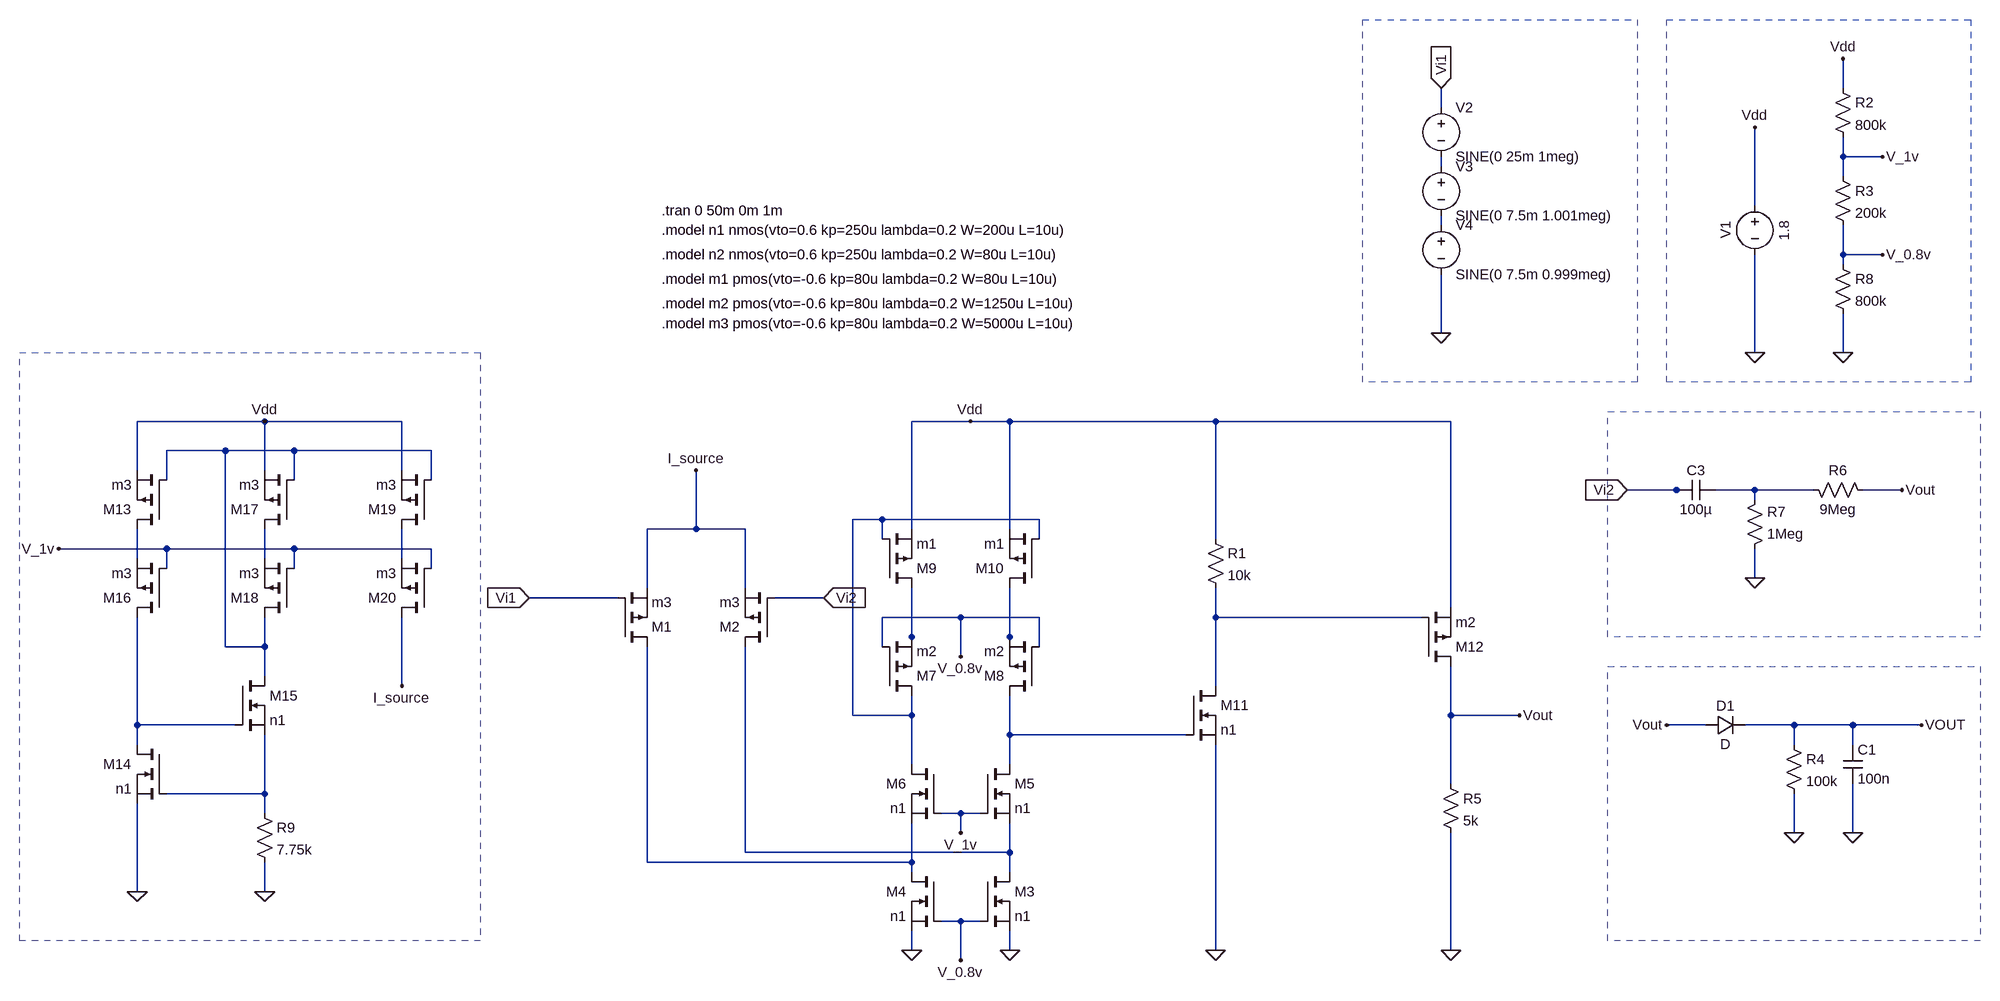
[diagram p0: schematic Draft19.asc]
Draft19.asc, the LTspice schematic file:
Version 4
SHEET 1 1988 868
WIRE 1696 -1040 1696 -1088
WIRE 1040 -1008 1040 -1040
WIRE 1696 -928 1696 -960
WIRE 1760 -928 1696 -928
WIRE 1040 -912 1040 -928
WIRE 1696 -896 1696 -928
WIRE 1552 -848 1552 -976
WIRE 1040 -816 1040 -832
WIRE 1696 -768 1696 -816
WIRE 1760 -768 1696 -768
WIRE 1696 -752 1696 -768
WIRE 1040 -640 1040 -736
WIRE 1552 -608 1552 -768
WIRE 1696 -608 1696 -672
WIRE -880 -496 -1088 -496
WIRE -656 -496 -880 -496
WIRE 272 -496 176 -496
WIRE 336 -496 272 -496
WIRE 672 -496 336 -496
WIRE 1056 -496 672 -496
WIRE -944 -448 -1040 -448
WIRE -832 -448 -944 -448
WIRE -608 -448 -832 -448
WIRE -1088 -416 -1088 -496
WIRE -880 -416 -880 -496
WIRE -656 -416 -656 -496
WIRE -1040 -400 -1040 -448
WIRE -832 -400 -832 -448
WIRE -608 -400 -608 -448
WIRE 1424 -384 1344 -384
WIRE 1440 -384 1424 -384
WIRE 1552 -384 1488 -384
WIRE 1648 -384 1552 -384
WIRE 1792 -384 1728 -384
WIRE 1552 -368 1552 -384
WIRE 128 -336 80 -336
WIRE 384 -336 128 -336
WIRE -176 -320 -176 -416
WIRE -176 -320 -256 -320
WIRE -96 -320 -176 -320
WIRE 176 -320 176 -496
WIRE 336 -320 336 -496
WIRE 128 -304 128 -336
WIRE 384 -304 384 -336
WIRE 672 -304 672 -496
WIRE -1040 -288 -1216 -288
WIRE -832 -288 -1040 -288
WIRE -608 -288 -832 -288
WIRE -1088 -272 -1088 -320
WIRE -880 -272 -880 -320
WIRE -656 -272 -656 -320
WIRE -1040 -256 -1040 -288
WIRE -832 -256 -832 -288
WIRE -608 -256 -608 -288
WIRE 1552 -240 1552 -288
WIRE -256 -224 -256 -320
WIRE -96 -224 -96 -320
WIRE -304 -208 -448 -208
WIRE 32 -208 -48 -208
WIRE 1056 -192 1056 -496
WIRE 256 -176 128 -176
WIRE 384 -176 256 -176
WIRE 672 -176 672 -224
WIRE 1008 -176 672 -176
WIRE 176 -144 176 -224
WIRE 336 -144 336 -224
WIRE -944 -128 -944 -448
WIRE -880 -128 -880 -176
WIRE -880 -128 -944 -128
WIRE 128 -128 128 -176
WIRE 176 -128 176 -144
WIRE 336 -128 336 -144
WIRE 384 -128 384 -176
WIRE 256 -112 256 -176
WIRE -880 -80 -880 -128
WIRE -656 -64 -656 -176
WIRE 672 -64 672 -176
WIRE 80 -16 80 -336
WIRE 176 -16 176 -48
WIRE 176 -16 80 -16
WIRE 1056 -16 1056 -96
WIRE 1168 -16 1056 -16
WIRE -1088 0 -1088 -176
WIRE -928 0 -1088 0
WIRE 1472 0 1408 0
WIRE 1616 0 1536 0
WIRE 1712 0 1616 0
WIRE 1824 0 1712 0
WIRE 336 16 336 -48
WIRE 624 16 336 16
WIRE -1088 32 -1088 0
WIRE 1616 32 1616 0
WIRE 1712 32 1712 0
WIRE 176 64 176 -16
WIRE 336 64 336 16
WIRE 1056 96 1056 -16
WIRE -880 112 -880 16
WIRE -880 112 -1040 112
WIRE -880 144 -880 112
WIRE 256 144 224 144
WIRE 288 144 256 144
WIRE 256 176 256 144
WIRE 1616 176 1616 112
WIRE 1712 176 1712 96
WIRE -96 208 -96 -128
WIRE 336 208 336 160
WIRE 336 208 -96 208
WIRE -256 224 -256 -128
WIRE 176 224 176 160
WIRE 176 224 -256 224
WIRE 176 240 176 224
WIRE 336 240 336 208
WIRE -1088 272 -1088 128
WIRE -880 272 -880 224
WIRE 256 320 224 320
WIRE 288 320 256 320
WIRE 176 368 176 336
WIRE 336 368 336 336
WIRE 672 368 672 32
WIRE 1056 368 1056 176
WIRE 256 384 256 320
FLAG 1552 -976 Vdd
FLAG 1552 -608 0
FLAG 272 -496 Vdd
FLAG 176 368 0
FLAG 336 368 0
FLAG 672 368 0
FLAG -448 -208 Vi1
IOPIN -448 -208 In
FLAG 1040 -1040 Vi1
IOPIN 1040 -1040 In
FLAG 1040 -640 0
FLAG 32 -208 Vi2
IOPIN 32 -208 In
FLAG 1056 368 0
FLAG 1552 -240 0
FLAG 1696 -608 0
FLAG 1696 -1088 Vdd
FLAG 1760 -928 V_1v
FLAG 256 176 V_1v
FLAG 1760 -768 V_0.8v
FLAG 256 -112 V_0.8v
FLAG 256 384 V_0.8v
FLAG -880 272 0
FLAG -1088 272 0
FLAG -880 -496 Vdd
FLAG -1216 -288 V_1v
FLAG -176 -416 I_source
FLAG -656 -64 I_source
FLAG 1792 -384 Vout
FLAG 1168 -16 Vout
FLAG 1344 -384 Vi2
IOPIN 1344 -384 In
FLAG 1616 176 0
FLAG 1712 176 0
FLAG 1408 0 Vout
FLAG 1824 0 VOUT
DATAFLAG -176 -320 ""
DATAFLAG -240 224 ""
DATAFLAG 336 208 ""
DATAFLAG 352 16 ""
DATAFLAG 336 -192 ""
DATAFLAG 176 0 ""
DATAFLAG 176 -208 ""
DATAFLAG 688 -176 ""
DATAFLAG 1056 0 ""
DATAFLAG 1696 -768 ""
DATAFLAG 1696 -928 ""
SYMBOL voltage 1552 -864 R0
WINDOW 0 -32 56 VBottom 2
WINDOW 3 32 56 VTop 2
WINDOW 123 0 0 Left 0
WINDOW 39 0 0 Left 0
SYMATTR InstName V1
SYMATTR Value 1.8
SYMBOL pmos -304 -128 M180
SYMATTR InstName M1
SYMATTR Value m3
SYMBOL pmos -48 -128 R180
SYMATTR InstName M2
SYMATTR Value m3
SYMBOL nmos 288 240 R0
SYMATTR InstName M3
SYMATTR Value n1
SYMBOL nmos 224 240 M0
SYMATTR InstName M4
SYMATTR Value n1
SYMBOL nmos 288 64 R0
SYMATTR InstName M5
SYMATTR Value n1
SYMBOL nmos 224 64 M0
SYMATTR InstName M6
SYMATTR Value n1
SYMBOL pmos 128 -48 M180
SYMATTR InstName M7
SYMATTR Value m2
SYMBOL pmos 384 -48 R180
SYMATTR InstName M8
SYMATTR Value m2
SYMBOL pmos 128 -224 M180
SYMATTR InstName M9
SYMATTR Value m1
SYMBOL pmos 384 -224 R180
SYMATTR InstName M10
SYMATTR Value m1
SYMBOL res 656 -320 R0
SYMATTR InstName R1
SYMATTR Value 10k
SYMBOL res 1040 80 R0
SYMATTR InstName R5
SYMATTR Value 5k
SYMBOL nmos 624 -64 R0
SYMATTR InstName M11
SYMATTR Value n1
SYMBOL pmos 1008 -96 M180
SYMATTR InstName M12
SYMATTR Value m2
SYMBOL res 1632 -400 M90
WINDOW 0 0 56 VBottom 2
WINDOW 3 32 56 VTop 2
SYMATTR InstName R6
SYMATTR Value 9Meg
SYMBOL res 1536 -272 M180
WINDOW 0 36 76 Left 2
WINDOW 3 36 40 Left 2
SYMATTR InstName R7
SYMATTR Value 1Meg
SYMBOL cap 1488 -400 R90
WINDOW 0 0 32 VBottom 2
WINDOW 3 32 32 VTop 2
SYMATTR InstName C3
SYMATTR Value 100µ
SYMBOL res 1680 -1056 R0
SYMATTR InstName R2
SYMATTR Value 800k
SYMBOL res 1680 -912 R0
SYMATTR InstName R3
SYMATTR Value 200k
SYMBOL res 1680 -768 R0
SYMATTR InstName R8
SYMATTR Value 800k
SYMBOL pmos -1040 -320 R180
SYMATTR InstName M13
SYMATTR Value m3
SYMBOL nmos -1040 32 M0
SYMATTR InstName M14
SYMATTR Value n1
SYMBOL nmos -928 -80 R0
SYMATTR InstName M15
SYMATTR Value n1
SYMBOL pmos -1040 -176 R180
SYMATTR InstName M16
SYMATTR Value m3
SYMBOL pmos -832 -320 R180
SYMATTR InstName M17
SYMATTR Value m3
SYMBOL pmos -832 -176 R180
SYMATTR InstName M18
SYMATTR Value m3
SYMBOL pmos -608 -320 R180
SYMATTR InstName M19
SYMATTR Value m3
SYMBOL pmos -608 -176 R180
SYMATTR InstName M20
SYMATTR Value m3
SYMBOL res -896 128 R0
SYMATTR InstName R9
SYMATTR Value 7.75k
SYMBOL voltage 1040 -1024 R0
WINDOW 123 0 0 Left 0
WINDOW 39 0 0 Left 0
SYMATTR InstName V2
SYMATTR Value SINE(0 25m 1meg)
SYMBOL voltage 1040 -928 R0
WINDOW 123 0 0 Left 0
WINDOW 39 0 0 Left 0
SYMATTR InstName V3
SYMATTR Value SINE(0 7.5m 1.001meg)
SYMBOL voltage 1040 -832 R0
WINDOW 123 0 0 Left 0
WINDOW 39 0 0 Left 0
SYMATTR InstName V4
SYMATTR Value SINE(0 7.5m 0.999meg)
SYMBOL cap 1696 32 R0
SYMATTR InstName C1
SYMATTR Value 100n
SYMBOL res 1600 16 R0
SYMATTR InstName R4
SYMATTR Value 100k
SYMBOL diode 1472 16 R270
WINDOW 0 32 32 VTop 2
WINDOW 3 0 32 VBottom 2
SYMATTR InstName D1
TEXT -232 -688 Left 2 !.model m2 pmos(vto=-0.6 kp=80u lambda=0.2 W=1250u L=10u)
TEXT -232 -840 Left 2 !.tran 0 50m 0m 1m
TEXT -232 -808 Left 2 !.model n1 nmos(vto=0.6 kp=250u lambda=0.2 W=200u L=10u)
TEXT -232 -768 Left 2 !.model n2 nmos(vto=0.6 kp=250u lambda=0.2 W=80u L=10u)
TEXT -232 -728 Left 2 !.model m1 pmos(vto=-0.6 kp=80u lambda=0.2 W=80u L=10u)
TEXT -232 -656 Left 2 !.model m3 pmos(vto=-0.6 kp=80u lambda=0.2 W=5000u L=10u)
LINE Normal 1312 -144 1312 -512 2
LINE Normal 1920 -144 1312 -144 2
LINE Normal 1920 -512 1920 -144 2
LINE Normal 1312 -512 1920 -512 2
RECTANGLE Normal 1920 352 1312 -96 2
RECTANGLE Normal 1904 -560 1408 -1152 2
RECTANGLE Normal 1360 -560 912 -1152 2
RECTANGLE Normal -528 352 -1280 -608 2

The netlist it stands for:
* Draft19.asc
V1 Vdd 0 1.8
M1 N016 Vi1 I_source I_source m3
M2 N015 Vi2 I_source I_source m3
M3 N015 V_0.8v 0 0 n1
M4 N016 V_0.8v 0 0 n1
M5 N013 V_1v N015 N015 n1
M6 N005 V_1v N016 N016 n1
M7 N005 V_0.8v N010 N010 m2
M8 N013 V_0.8v N011 N011 m2
M9 N010 N005 Vdd Vdd m1
M10 N011 N005 Vdd Vdd m1
R1 Vdd N009 10k
R5 Vout 0 5k
M11 N009 N013 0 0 n1
M12 Vout N009 Vdd Vdd m2
R6 N004 Vout 9Meg
R7 0 N004 1Meg
C3 N004 Vi2 100µ
R2 Vdd V_1v 800k
R3 V_1v V_0.8v 200k
R8 V_0.8v 0 800k
M13 N006 N003 Vdd Vdd m3
M14 N012 N014 0 0 n1
M15 N003 N012 N014 N014 n1
M16 N012 V_1v N006 N006 m3
M17 N007 N003 Vdd Vdd m3
M18 N003 V_1v N007 N007 m3
M19 N008 N003 Vdd Vdd m3
M20 I_source V_1v N008 N008 m3
R9 N014 0 7.75k
V2 Vi1 N001 SINE(0 25m 1meg)
V3 N001 N002 SINE(0 7.5m 1.001meg)
V4 N002 0 SINE(0 7.5m 0.999meg)
C1 Vout 0 100n
R4 Vout 0 100k
D1 Vout Vout D
.model D D
.lib standard.dio
.model NMOS NMOS
.model PMOS PMOS
.lib standard.mos
.model m2 pmos(vto=-0.6 kp=80u lambda=0.2 W=1250u L=10u)
.tran 0 50m 0m 1m
.model n1 nmos(vto=0.6 kp=250u lambda=0.2 W=200u L=10u)
.model n2 nmos(vto=0.6 kp=250u lambda=0.2 W=80u L=10u)
.model m1 pmos(vto=-0.6 kp=80u lambda=0.2 W=80u L=10u)
.model m3 pmos(vto=-0.6 kp=80u lambda=0.2 W=5000u L=10u)
.backanno
.end